# EAGLE design HEBreakoutrev2 (EAGLE 9.6.1)
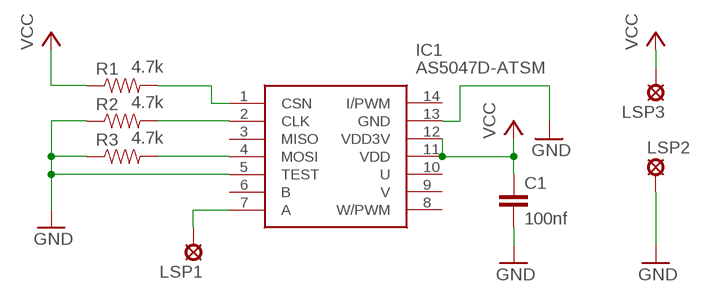
[diagram p0: schematic, sheet 1]

## Parts
C1  100nf  CAP0603-CAP  [0603-CAP]
IC1  AS5047D-ATSM  [SOP65P640X120-14N]
LSP1  LSP10  [LSP10]
LSP2  LSP10  [LSP10]
LSP3  LSP10  [LSP10]
R1  4.7k  RESISTOR0603  [0603-RES]
R2  4.7k  RESISTOR0603  [0603-RES]
R3  4.7k  RESISTOR0603  [0603-RES]

## Nets
GND: C1.2 IC1.5(TEST) IC1.13(GND) LSP2.MP R2.1 R3.1
N$1: IC1.1(CSN) R1.2
N$2: IC1.2(CLK) R2.2
N$3: IC1.4(MOSI) R3.2
N$5: IC1.7(A) LSP1.MP
VCC: C1.1 IC1.11(VDD) IC1.12(VDD3V) LSP3.MP R1.1
Unconnected: IC1.3(MISO) IC1.6(B) IC1.8(W/PWM) IC1.9(V) IC1.10(U) IC1.14(I/PWM)

## Library data of the parts
C1 = HyTechDevices:CAP: Capacitor Standard 0603 ceramic capacitor, and 0.1" leaded capacitor.
IC1 = AS5047D-ATSM:AS5047D-ATSM: ams AS5047D-ATSM Hall Effect Sensor 14-Pin TSSOP, 3 3.6 V, 4.5 5.5 V Source: Datasheet <http://ams.com/eng/content/download/595083/1609657/320155>; ARROW_PART_NUMBER: AS5047D-ATSM; ARROW_PRICE-STOCK: https://www.arrow.com/en/products/as5047d-atsm/ams-ag; DESCRIPTION: ams AS5047D-ATSM Hall Effect Sensor 14-Pin TSSOP, 3 3.6 V, 4.5 5.5 V; HEIGHT: 1.2mm; MANUFACTURER_NAME: ams; MANUFACTURER_PART_NUMBER: AS5047D-ATSM; MOUSER_PART_NUMBER: 985-AS5047D-ATSM; MOUSER_PRICE-STOCK: https://www.mouser.co.uk/ProductDetail/ams/AS5047D-ATSM?qs=qEcPHXRbv51jEdbehV7Mjw%3D%3D
LSP1-LSP3 = solpad:LSP10: SOLDER PAD drill 1.0 mm, distributor Buerklin, 12H555
R1-R3 = HyTechDevices:RESISTOR: Resistor Basic schematic elements and footprints for 0603, 1206, and PTH resistors.

## Board
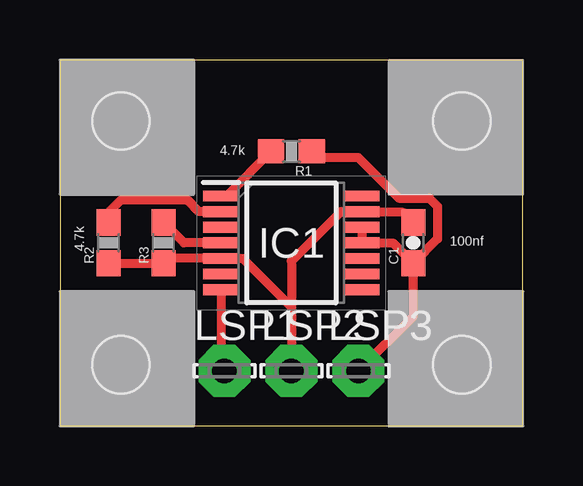
[diagram p1: board, top side]
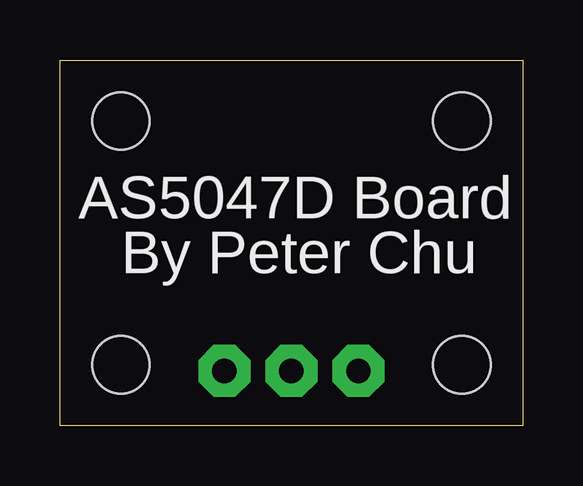
[diagram p2: board, bottom side, seen from below]

Size 19.3 x 15.24 mm. Coordinates in mm from the lower left corner, seen from the top.
Outline: 0,0 19.3,0 19.3,15.24 0,15.24 0,0
Copper layers (1*16): Top 0.035mm / dielectric 1.5mm / Bottom 0.035mm
Design rules "default": minimum track width 6mil, minimum drill 0.35mm, track to track 6mil, track to pad 6mil, pad to pad 6mil, via to via 6mil, smd to smd 6mil, copper to edge 40mil, drill to drill 6mil, minimum pad ring 10mil, minimum via ring 8mil, stop-mask expansion 4mil, vias tented up to drill 0mil, thermal gap 10mil
Holes 2.39 mm at 2.54,2.54 16.76,2.54 16.76,12.7 2.54,12.7

### Footprints (pad centres in the part's own frame; a part is rotated, then mirrored left to right if it is on the bottom)
0603-CAP = smd 1.1 x 1: 1 -0.85,0; 2 0.85,0
SOP65P640X120-14N = smd 1.475 x 0.45: 1 -2.938,1.95; 2 -2.938,1.3; 3 -2.938,0.65; 4 -2.938,0; 5 -2.938,-0.65; 6 -2.938,-1.3; 7 -2.938,-1.95; 8 2.938,-1.95; 9 2.938,-1.3; 10 2.938,-0.65; 11 2.938,0; 12 2.938,0.65; 13 2.938,1.3; 14 2.938,1.95
LSP10 = drill 1.016 pad 2.159 octagon: MP 0,0
0603-RES = smd 1.1 x 1: 1 -0.85,0; 2 0.85,0

### Placement (x,y rotation side)
C1  14.73,7.62 90 top
IC1  9.65,7.62 0 top
LSP1  6.86,2.29 0 top
LSP2  9.65,2.29 0 top
LSP3  12.45,2.29 0 top
R1  9.65,11.43 180 top
R2  2.03,7.62 90 top
R3  4.32,7.62 90 top

### Tracks (layer width: path | path; a pad name or v marks a point on that pad's centre or on a via)
GND
  Top 0.381: C1.2 14.31,8.89 12.62,8.89 IC1.13 11.71,8.92 9.65,6.86 9.65,4.94 | R2.1 R3.1 4.52,6.97 IC1.5 7.62,6.97 9.65,4.94 | 9.65,4.94 LSP2.MP
N$1
  Top 0.381: R1.2 6.94,9.57 IC1.1
N$2
  Top 0.381: IC1.2 5.81,8.92 5.33,9.4 2.54,9.4 2.03,8.89 R2.2
N$3
  Top 0.381: R3.2 5.17,7.62 IC1.4
N$5
  Top 0.381: IC1.7 6.71,2.43 LSP1.MP
VCC
  Top 0.381: IC1.12 IC1.11 13.88,7.62 C1.1 | R1.1 10.76,11.18 12.44,11.18 14.13,9.48 15.41,9.48 15.75,9.14 15.75,7.79 C1.1 | C1.1 14.73,4.57 LSP3.MP

### Text on the board
bPlace: AS5047D Board | By Peter Chu